# EAGLE design MultiboardV2 (EAGLE 9.2.2)
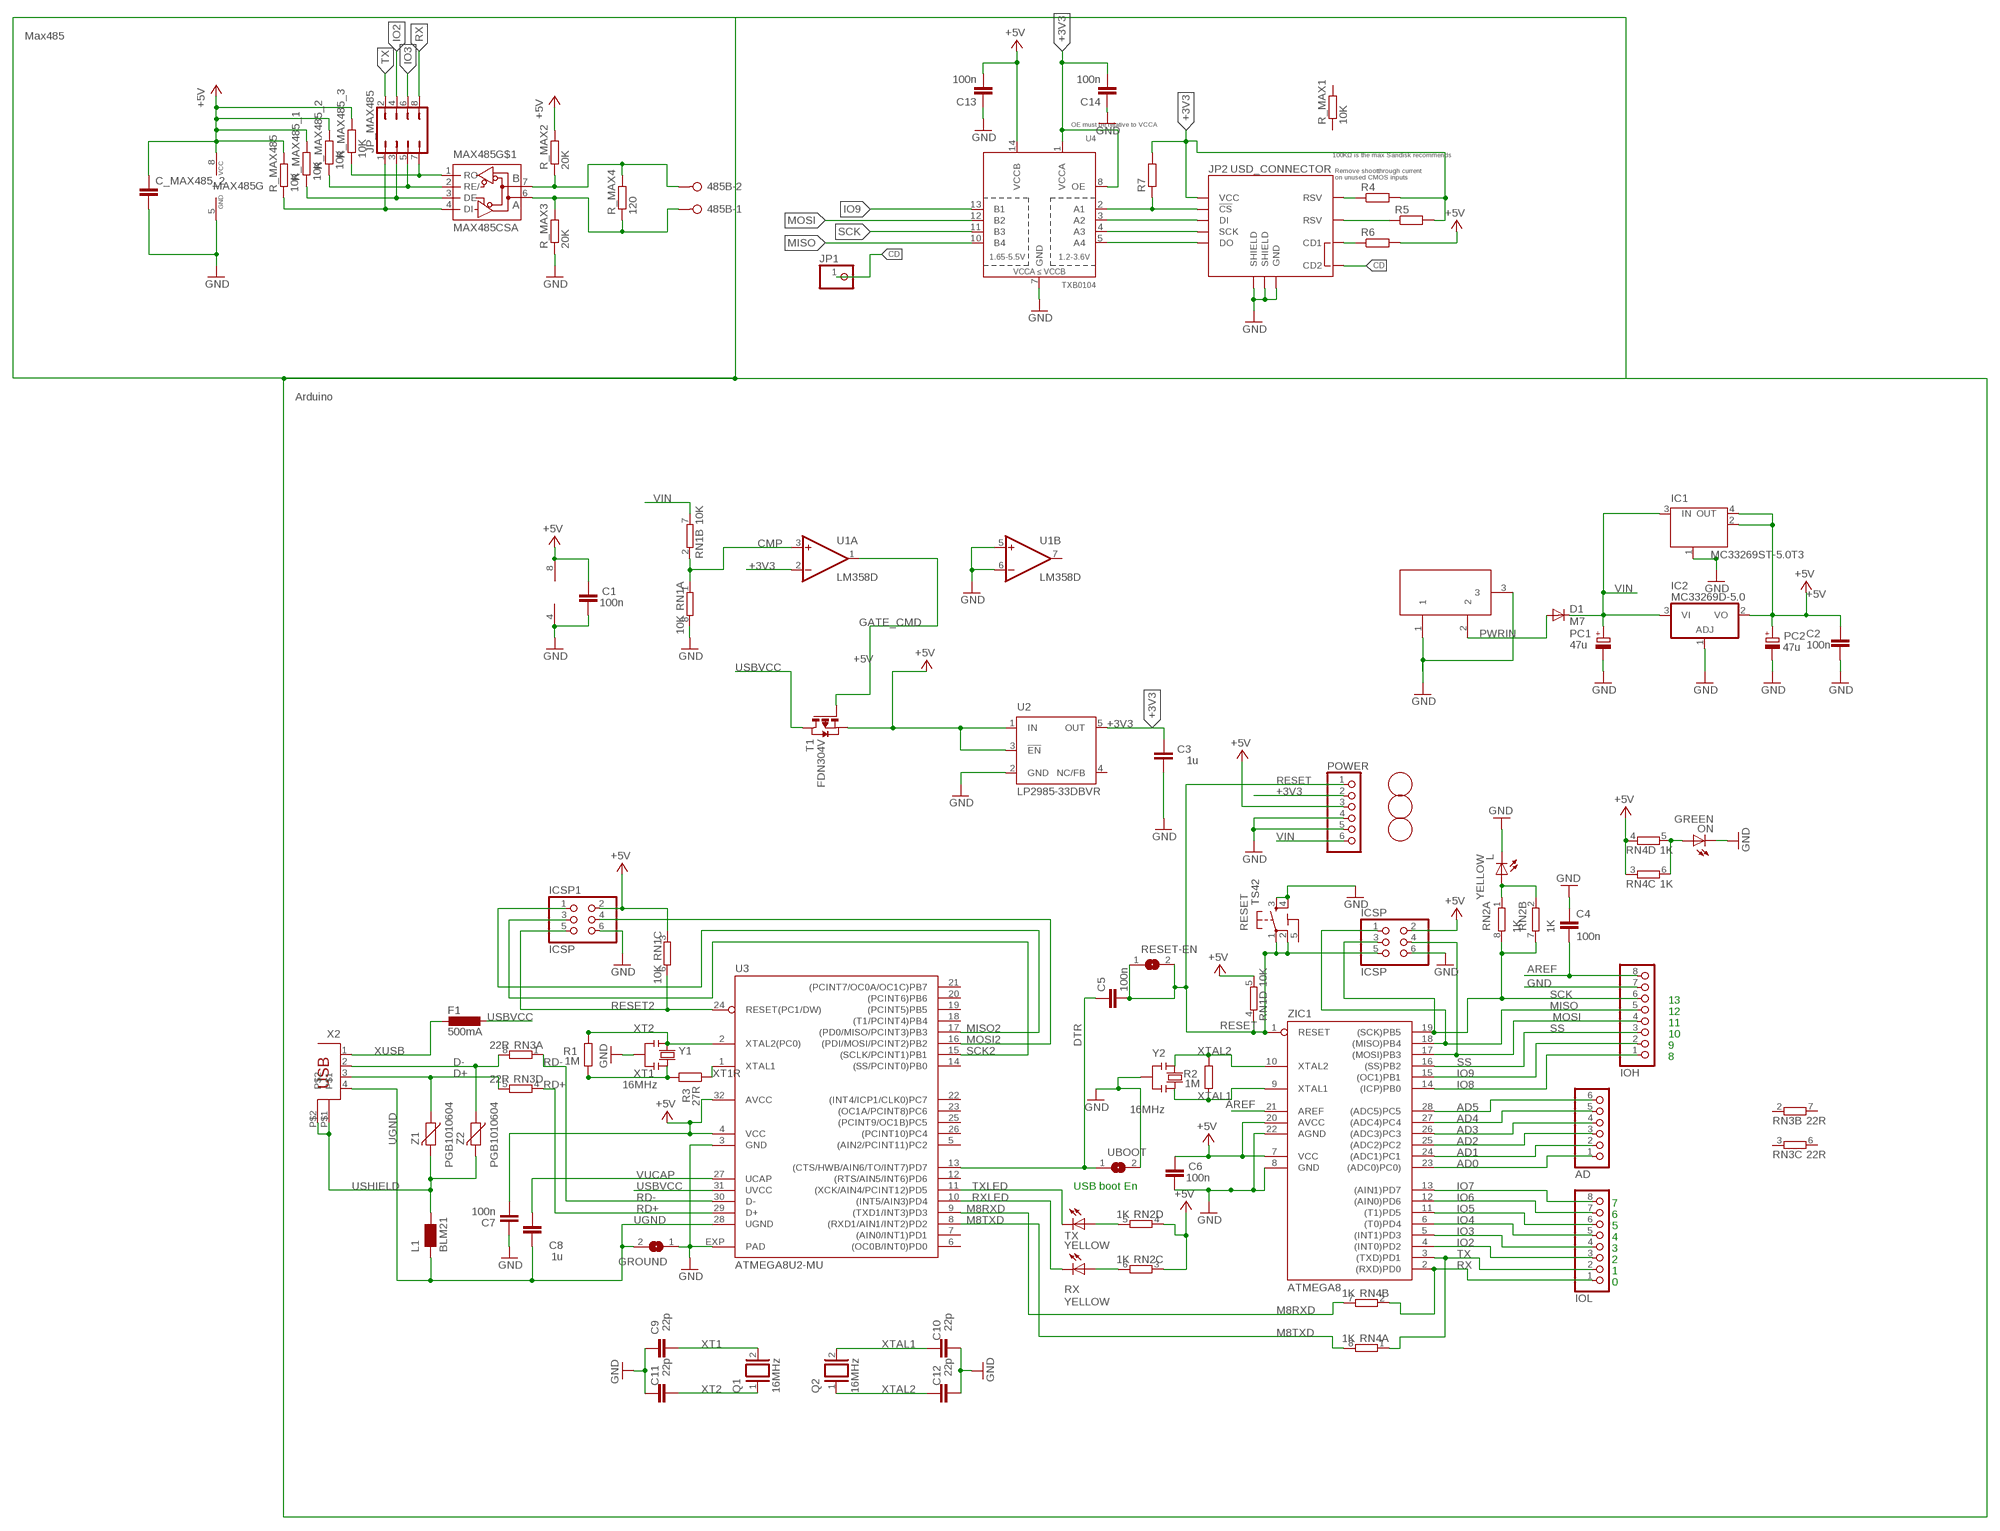
[diagram p0: schematic, sheet 1]

## Parts
485B  W237-02P  [W237-132]
AD  PINHD-1X6  [1X06]
C1  100n  C-EU0603-RND  [C0603-ROUND]
C2  100n  C-EU0603-RND  [C0603-ROUND]
C3  1u  C-EU0603-RND  [C0603-ROUND]
C4  100n  C-EU0603-RND  [C0603-ROUND]
C5  100n  C-EU0603-RND  [C0603-ROUND]
C6  100n  C-EU0603-RND  [C0603-ROUND]
C7  100n  C-EU0603-RND  [C0603-ROUND]
C8  1u  C-EU0603-RND  [C0603-ROUND]
C9  22p  C-EU0603-RND  [C0603-ROUND]
C10  22p  C-EU0603-RND  [C0603-ROUND]
C11  22p  C-EU0603-RND  [C0603-ROUND]
C12  22p  C-EU0603-RND  [C0603-ROUND]
C13  100n  C-EU0603-RND  [C0603-ROUND]
C14  100n  C-EU0603-RND  [C0603-ROUND]
C_MAX485_2  C-EUC0402  [C0402]
D1  M7  DIODE-SMB  [SMB]
F1  500mA  L-EUL1812  [L1812]
GROUND  SJ  [SJ]
IC1  MC33269ST-5.0T3  MC33269ST-3.3T3  [SOT223]
IC2  MC33269D-5.0  [DPACK]
ICSP  ICSP  PINHD-2X3  [2X03]
ICSP1  ICSP  PINHD-2X3  [2X03]
IOH  PINHD-1X8  [1X08]
IOL  PINHD-1X8  [1X08]
JP1  PINHD-1X1  [1X01]
JP2  USD_CONNECTOR  [MICRO-SD-SOCKET-PP]
JP_MAX485  JP4Q  [JP4Q]
L  YELLOW  LEDCHIP-LED0805  [CHIP-LED0805]
L1  BLM21  WE-CBF_0805  [0805]
MAX485  MAX485CSA  [SO08]
ON  GREEN  LEDCHIP-LED0805  [CHIP-LED0805]
PC1  47u  CPOL-EUD  [PANASONIC_D]
PC2  47u  CPOL-EUD  [PANASONIC_D]
POWER  PINHD-1X6  [1X06]
Q1  16MHz  XTAL/S  [QS]
Q2  16MHz  XTAL/S  [QS]
R1  1M  R-EU_R0603  [R0603-ROUND]
R2  1M  R-EU_R0603  [R0603-ROUND]
R3  27R  R-EU_R0603  [R0603-ROUND]
R4  100k  R-EU_R0402  [R0402]
R5  100k  R-EU_R0402  [R0402]
R6  100k  R-EU_R0402  [R0402]
R7  100k  R-EU_R0402  [R0402]
R_MAX1  10K  R-EU_R0402  [R0402]
R_MAX2  20K  R-EU_R0402  [R0402]
R_MAX3  20K  R-EU_R0402  [R0402]
R_MAX4  120  R-EU_R0402  [R0402]
R_MAX485  10K  R-EU_R0402  [R0402]
R_MAX485_1  10K  R-EU_R0402  [R0402]
R_MAX485_2  10K  R-EU_R0402  [R0402]
R_MAX485_3  10K  R-EU_R0402  [R0402]
RESET  TS42  [TS42]
RESET-EN  SJ  [SJ]
RN1  10K  4R-NCAY16  [CAY16]
RN2  1K  4R-NCAY16  [CAY16]
RN3  22R  4R-NCAY16  [CAY16]
RN4  1K  4R-NCAY16  [CAY16]
RX  YELLOW  LEDCHIP-LED0805  [CHIP-LED0805]
T1  FDN304V  PMOSSOT23  [SOT-23]
TX  YELLOW  LEDCHIP-LED0805  [CHIP-LED0805]
U1  LM358D  [SO08]
U2  LP2985-33DBVR  TPS77033  [SOT23-DBV]
U3  ATMEGA8U2-MU  [QFN32]
U4  TXB0104  TXB0104PWRSOIC14  [SO14]
U$3  FIDUCIALMOUNT  [FIDUCIA-MOUNT]
U$4  FIDUCIALMOUNT  [FIDUCIA-MOUNT]
U$6  FIDUCIALMOUNT  [FIDUCIA-MOUNT]
UBOOT  SJ  [SJ]
X1  DC21MMX  [DC-21MM]
X2  PN61729  [PN61729]
Y1  16MHz  RESONATORMU  [RESONATOR]
Y2  16MHz  RESONATORMU  [RESONATOR]
Z1  PGB1010604  VARISTORCN0603  [CT/CN0603]
Z2  PGB1010604  VARISTORCN0603  [CT/CN0603]
ZIC1  ATMEGA8  AT90S4433P  [DIL28-3]

## Nets
!CS_3V3: JP2.CS(!CS) R7.1 U4.2(A1)
+3V3: C3.2 C14.2 JP2.VCC POWER.2 R4.2 R5.2 R7.2 U1.2(A:-IN) U2.5(OUT) U4.1(VCCA) U4.8(OE)
+5V: C1.2 C2.2 C6.2 C7.1 C13.2 C_MAX485_2.1 IC1.2(OUT) IC1.4(OUT) IC2.2(VO) ICSP1.2 ICSP.2 MAX485.8(G:VCC) PC2.+ POWER.3 R6.2 R_MAX2.2 R_MAX485.2 R_MAX485_1.2 R_MAX485_2.2 R_MAX485_3.2 RN1.3 RN1.5 RN2.3 RN2.4 RN4.3 RN4.4 T1.2(S) U1.8(P:V+) U2.1(IN) U2.3(!EN) U3.4(VCC) U3.32(AVCC) U4.14(VCCB) ZIC1.7(VCC) ZIC1.20(AVCC)
AD0: AD.1 ZIC1.23((ADC0)PC0))
AD1: AD.2 ZIC1.24((ADC1)PC1)
AD2: AD.3 ZIC1.25((ADC2)PC2)
AD3: AD.4 ZIC1.26((ADC3)PC3)
AD4: AD.5 ZIC1.27((ADC4)PC4)
AD5: AD.6 ZIC1.28((ADC5)PC5)
AREF: C4.2 IOH.8 ZIC1.21(AREF)
CD: JP1.1 JP2.CD2
CDSDSD: JP2.CD1 R6.1
CMP: RN1.1 RN1.2 U1.3(A:+IN)
D+: RN3.5 X2.3 Z1.1
D-: RN3.8 X2.2 Z2.1
DI_3V3: JP2.DI U4.3(A2)
DO_3V3: JP2.DO U4.5(A4)
DTR: C5.1 U3.13((CTS/HWB/AIN6/TO/INT7)PD7) UBOOT.1
GATE_CMD: T1.3(G) U1.1(A:OUT)
GND: C1.1 C2.1 C3.1 C4.1 C6.1 C7.2 C9.2 C10.1 C11.2 C12.1 C13.1 C14.1 C_MAX485_2.2 GROUND.1 IC1.1(GND/ADJ) IC2.1(ADJ) ICSP1.6 ICSP.6 IOH.7 JP2.GND JP2.GND1(SHIELD) JP2.GND3(SHIELD) L.C MAX485.5(G:GND) ON.C PC1.- PC2.- POWER.4 POWER.5 R_MAX3.1 RESET.3 RESET.4 RN1.8 U1.4(P:V-) U1.5(B:+IN) U1.6(B:-IN) U2.2(GND) U3.3(GND) U3.EXP(PAD) U4.7(GND) UBOOT.2 X1.1 X1.3 Y1.2 Y2.2 ZIC1.8(GND) ZIC1.22(AGND)
IO2: IOL.3 JP_MAX485.4 ZIC1.4((INT0)PD2)
IO3: IOL.4 JP_MAX485.6 ZIC1.5((INT1)PD3)
IO4: IOL.5 ZIC1.6((T0)PD4)
IO5: IOL.6 ZIC1.11((T1)PD5)
IO6: IOL.7 ZIC1.12((AIN0)PD6)
IO7: IOL.8 ZIC1.13((AIN1)PD7)
IO8: IOH.1 ZIC1.14((ICP)PB0)
IO9: IOH.2 U4.13(B1) ZIC1.15((OC1)PB1)
M8RXD: RN4.7 U3.9((TXD1/INT3)PD3)
M8TXD: RN4.8 U3.8((RXD1/AIN1/INT2)PD2)
MISO: ICSP.1 IOH.5 U4.10(B4) ZIC1.18((MISO)PB4)
MISO2: ICSP1.1 U3.17((PD0/MISO/PCINT3)PB3)
MOSI: ICSP.4 IOH.4 U4.12(B2) ZIC1.17((MOSI)PB3)
MOSI2: ICSP1.4 U3.16((PDI/MOSI/PCINT2)PB2)
N$2: L.A RN2.1 RN2.2
N$3: ON.A RN4.5 RN4.6
N$4: JP_MAX485.7 MAX485.1(RO) R_MAX485_3.1
N$5: JP_MAX485.5 MAX485.2(RE/) R_MAX485_2.1
N$6: JP_MAX485.3 MAX485.3(DE) R_MAX485_1.1
N$7: JP_MAX485.1 MAX485.4(DI) R_MAX485.1
N$9: 485B.2 MAX485.7(B) R_MAX2.1 R_MAX4.2
N$10: 485B.1 MAX485.6(A) R_MAX3.2 R_MAX4.1
N$35: RN2.6 RX.A
N$36: RN2.5 TX.A
PWRIN: D1.A X1.2
RD+: RN3.4 U3.29(D+)
RD-: RN3.1 U3.30(D-)
RESET: C5.2 ICSP.5 POWER.1 RESET-EN.1 RESET-EN.2 RESET.1 RESET.2 RN1.4 ZIC1.1(RESET)
RESET2: ICSP1.5 RN1.6 U3.24(RESET(PC1/DW))
RSV@1: JP2.RSV1(RSV) R4.1
RSV@2: JP2.RSV2(RSV) R5.1
RX: IOL.1 JP_MAX485.8 RN4.2 ZIC1.2((RXD)PD0)
RXLED: RX.C U3.10((INT5/AIN3)PD4)
SCK: ICSP.3 IOH.6 RN2.7 RN2.8 U4.11(B3) ZIC1.19((SCK)PB5)
SCK2: ICSP1.3 U3.15((SCLK/PCINT1)PB1)
SCK_3V3: JP2.SCLK(SCK) U4.4(A3)
SS: IOH.3 ZIC1.16((SS)PB2)
TX: IOL.2 JP_MAX485.2 RN4.1 ZIC1.3((TXD)PD1)
TXLED: TX.C U3.11((XCK/AIN4/PCINT12)PD5)
UGND: C8.2 GROUND.2 L1.1 U3.28(UGND) X2.4
USBVCC: F1.1 T1.1(D) U3.31(UVCC)
USHIELD: L1.2 X2.P$1 X2.P$2 Z1.2 Z2.2
VIN: D1.C IC1.3(IN) IC2.3(VI) PC1.+ POWER.6 RN1.7
VUCAP: C8.1 U3.27(UCAP)
XT1: C9.1 Q1.2 R1.1 R3.2 Y1.3
XT1R: R3.1 U3.1(XTAL1)
XT2: C11.1 Q1.1 R1.2 U3.2(XTAL2(PC0)) Y1.1
XTAL1: C10.2 Q2.2 R2.1 Y2.3 ZIC1.9(XTAL1)
XTAL2: C12.2 Q2.1 R2.2 Y2.1 ZIC1.10(XTAL2)
XUSB: F1.2 X2.1
Unconnected: R_MAX1.1 R_MAX1.2 RN3.2 RN3.3 RN3.6 RN3.7 U1.7(B:OUT) U2.4(NC/FB) U3.5((AIN2/PCINT11)PC2) U3.6((OC0B/INT0)PD0) U3.7((AIN0/INT1)PD1) U3.12((RTS/AIN5/INT6)PD6) U3.14((SS/PCINT0)PB0) U3.18((T1/PCINT4)PB4) U3.19((PCINT5)PB5) U3.20((PCINT6)PB6) U3.21((PCINT7/OC0A/OC1C)PB7) U3.22((INT4/ICP1/CLK0)PC7) U3.23((OC1A/PCINT8)PC6) U3.25((PCINT9/OC1B)PC5) U3.26((PCINT10)PC4)

## Notes on the sheet
- Max485
- OE must be relative to VCCA
- 100KΩ is the max Sandisk recommends
- Remove shootthrough current
  on unused CMOS inputs
- Arduino
- 13
- 12
- 11
- 10
- 9
- 8
- USB boot En
- 7
- 6
- 5
- 4
- 3
- 2
- 1
- 0

## Power pins joined to a net without a drawn wire
5-GND: RESET.5(5-GND)

## Library data of the parts
485B = con-wago-508:W237-02P: WAGO SREW CLAMP; OC_FARNELL: unknown; OC_NEWARK: unknown
AD POWER = pinhead:PINHD-1X6: PIN HEADER
C1-C14 = SmartPrj:C-EU: CAPACITOR, European symbol
C_MAX485_2 = rcl:C-EU: CAPACITOR, European symbol; SPICEPREFIX: C
D1 = diode:DIODE-: DIODE
F1 = rcl:L-EU: INDUCTOR, European symbol
GROUND RESET-EN UBOOT = jumper:SJ: SMD solder JUMPER
IC1 = linear:MC33269ST*: Adjustable Output Low Dropout Voltage Regulator 800 mA Source: http://www.onsemi.com/pub/Collateral/MC33269-D.PDF
IC2 = linear:MC33269?*: Adjustable Output Low Dropout Voltage Regulator 800 mA Source: http://www.onsemi.com/pub/Collateral/MC33269-D.PDF
ICSP ICSP1 = pinhead:PINHD-2X3: PIN HEADER
IOH IOL = pinhead:PINHD-1X8: PIN HEADER
JP1 = pinhead:PINHD-1X1: PIN HEADER
JP2 = SparkFun-Connectors:USD_CONNECTOR: microSD Socket Push-push type µSD socket. Footprint production proven. Symbol has new and improved layout and naming accuracy. SparkFun Electronics SKU : PRT-00127. tDoc lines correctly indicate media card edge positions when inserting (unlocked, locked, depressed). NOTE: CD1 and CD2 are connected internally; PROD_ID: CONN-07820
JP_MAX485 = jumper:JP4Q: JUMPER
L ON RX TX = led:LED: LED OSRAM: - CHIPLED LG R971, LG N971, LY N971, LG Q971, LY Q971, LO R971, LY R971 LH N974, LH R974 LS Q976, LO Q976, LY Q976 LO Q996 - Hyper CHIPLED LW Q18S LB Q993, LB Q99A, LB R99A - SideLED LS A670, LO A670, LY A670, LG A670, LP A670 LB A673, LV A673, LT A673, LW A673 LH A674 LY A675 LS A676, LA A676, LO A676, LY A676, LW A676 LS A679, LY A679, LG A679 - Hyper Micro SIDELED® LS Y876, LA Y876, LO Y876, LY Y876 LT Y87S - SmartLED LW L88C, LW L88S LB L89C, LB L89S, LG L890 LS L89K, LO L89K, LY L89K LS L896, LA L896, LO L896, LY L896 - TOPLED LS T670, LO T670, LY T670, LG T670, LP T670 LSG T670, LSP T670, LSY T670, LOP T670, LYG T670 LG T671, LOG T671, LSG T671 LB T673, LV T673, LT T673, LW T673 LH T674 LS T676, LA T676, LO T676, LY T676, LB T676, LH T676, LSB T676, LW T676 LB T67C, LV T67C, LT T67C, LS T67K, LO T67K, LY T67K, LW E67C LS E67B, LA E67B, LO E67B, LY E67B, LB E67C, LV E67C, LT E67C LW T67C LS T679, LY T679, LG T679 LS T770, LO T770, LY T770, LG T770, LP T770 LB T773, LV T773, LT T773, LW T773 LH T774 LS E675, LA E675, LY E675, LS T675 LS T776, LA T776, LO T776, LY T776, LB T776 LHGB T686 LT T68C, LB T68C - Hyper Mini TOPLED® LB M676 - Mini TOPLED Santana® LG M470 LS M47K, LO M47K, LY M47K Source: http://www.osram.convergy.de LUXEON: - LUMILED® LXK2-PW12-R00, LXK2-PW12-S00, LXK2-PW14-U00, LXK2-PW14-V00 LXK2-PM12-R00, LXK2-PM12-S00, LXK2-PM14-U00 LXK2-PE12-Q00, LXK2-PE12-R00, LXK2-PE12-S00, LXK2-PE14-T00, LXK2-PE14-U00 LXK2-PB12-K00, LXK2-PB12-L00, LXK2-PB12-M00, LXK2-PB14-N00, LXK2-PB14-P00, LXK2-PB14-Q00 LXK2-PR12-L00, LXK2-PR12-M00, LXK2-PR14-Q00, LXK2-PR14-R00 LXK2-PD12-Q00, LXK2-PD12-R00, LXK2-PD12-S00 LXK2-PH12-R00, LXK2-PH12-S00 LXK2-PL12-P00, LXK2-PL12-Q00, LXK2-PL12-R00 Source: www.luxeon.com KINGBRIGHT: KA-3528ASYC Source: www.kingbright.com
L1 = wuerth-elektronik:WE-CBF: SMD EMI Suppression Ferrite Beads - excellent anti-EMI properties - low DCR - impedances till 3000 ohms - rated current up to 6 A
MAX485 = andereBauteile:MAX485: MAX485 RS485 Half Duplex Driver
PC1 PC2 = rcl:CPOL-EU: POLARIZED CAPACITOR, European symbol
Q1 Q2 = special:XTAL/S: CRYSTAL
R1-R3 = SmartPrj:R-EU_: RESISTOR, European symbol
R4-R7 R_MAX1-R_MAX4 R_MAX485 R_MAX485_1-R_MAX485_3 = rcl:R-EU_: RESISTOR, European symbol; SPICEPREFIX: R
RESET = st-mod v1.4:TS42: TS42 Dongnan Electronics Tact switch VDC 12V - 50mA
RN1-RN4 = resistor-dil:4R-N: Array Chip Resistor Source: RS Component / Phycomp
T1 = zetex:PMOSSOT23: MOS FET
U1 = linear:LM358: OP AMP also LM158; LM258; LM2904 Source: http://cache.national.com/ds/LM/LM158.pdf
U2 = texas:TPS770*: ULTRALOW-POWER 50-mA LOW-DROPOUT LINEAR REGULATORS 50-mA Low-Dropout Regulator Source: http://focus.ti.com/lit/ds/symlink/tps77001.pdf
U3 = atmel:ATMEGA8U2-MU
U4 = SparkFun-DigitalIC:TXB0104PWR: 4-Bit Bi-Directional Level Shifter 1.2V-3.6V (VCCA) to 1.65V-5.5V (VCCB) bi-directional level shifter with auto direction sensing. Max data rate - VCCA 1.8V: 20Mbps (50ns), VCCA 3.3V: 100Mbps (10ns) Digikey: 296-21929-1-ND (TSSOP) IC-11329; PROD_ID: IC-11329
U$3 U$4 U$6 = SmartPrj:FIDUCIALMOUNT
X1 = powersupply:DC21MM
X2 = SmartPrj:PN61729: BERG USB connector
Y1 Y2 = SmartPrj:RESONATOR
Z1 Z2 = varistor:VARISTOR: VARISTOR
ZIC1 = atmel:AT90S4433: MICROCONTROLLER 4 Kbytes FLASH 128 bytes SRAM 256 bytes EEPROM UART 6-channel 10 bit ADC

## Board
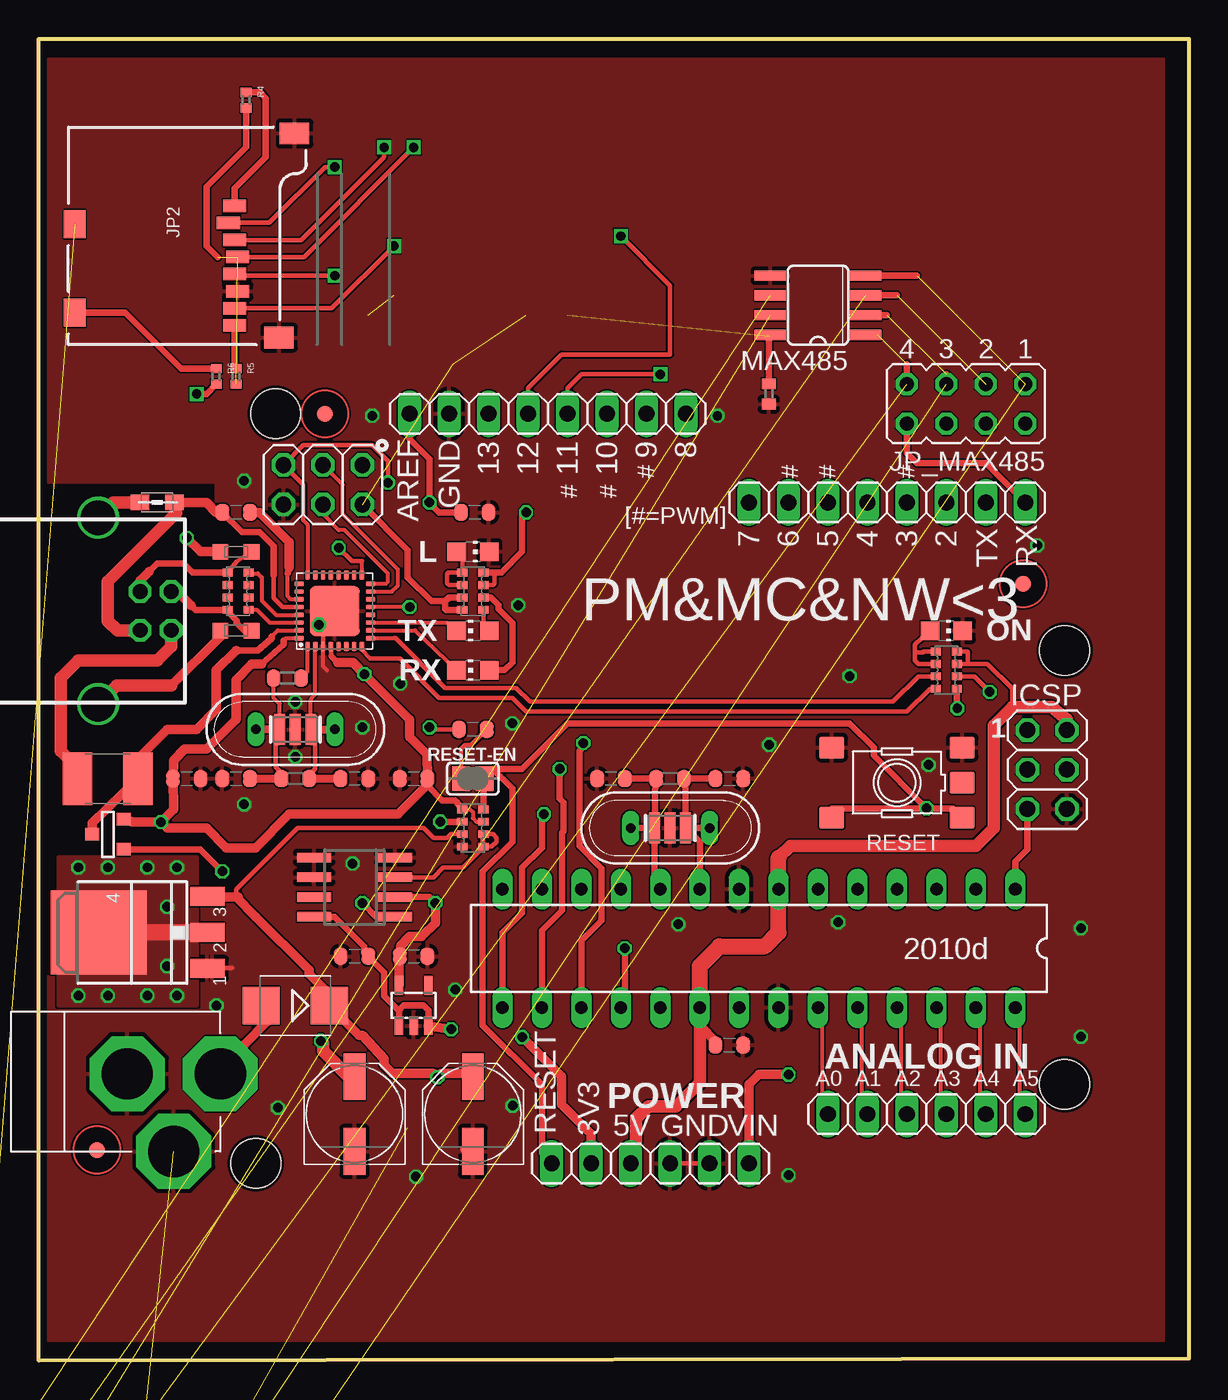
[diagram p1: board, top side]
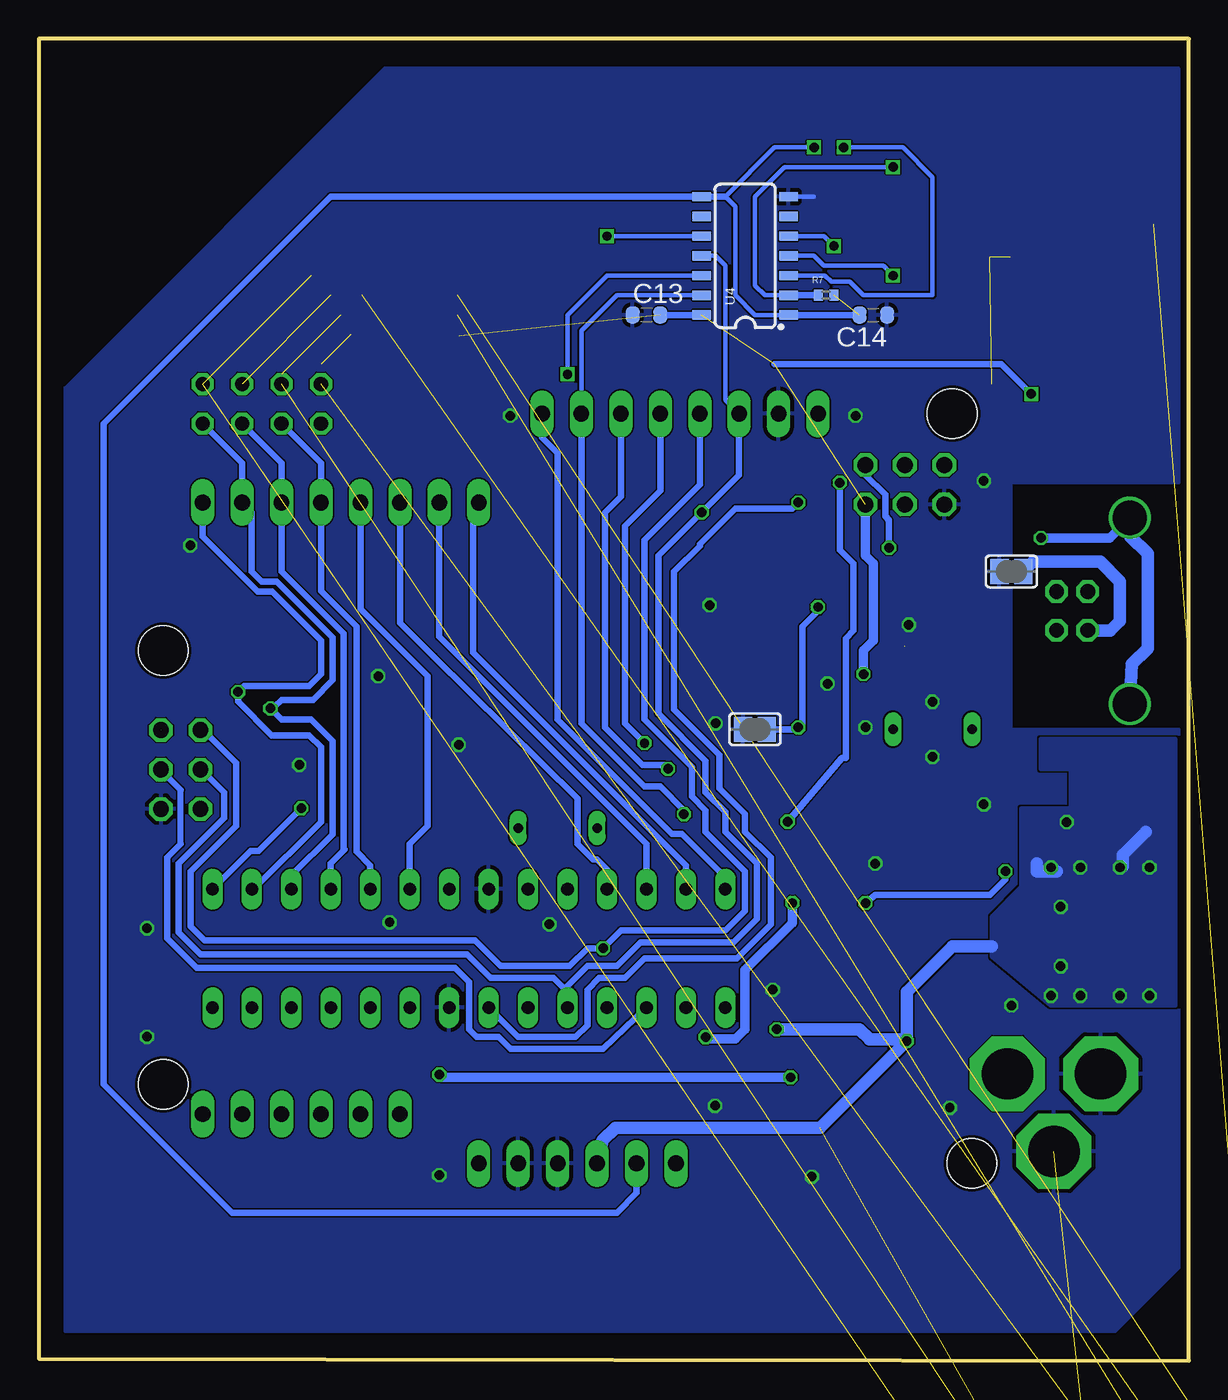
[diagram p2: board, bottom side, seen from below]

Size 74.04 x 85.09 mm. Coordinates in mm from the lower left corner, seen from the top.
Outline: 0,85.09 74.04,85.09 74.04,0.13 0,0 0,85.09
Copper layers (1*16): Top 0.035mm / dielectric 1.5mm / Bottom 0.035mm
Design rules "Aisler": minimum track width 0.1mm, minimum drill 0.2mm, track to track 0.1mm, track to pad 0.1mm, pad to pad 0.1mm, via to via 0.1mm, smd to smd 0.1mm, copper to edge 0.2mm, drill to drill 0.21mm, minimum pad ring 0.25mm, minimum via ring 0.15mm, stop-mask expansion 0mil, vias tented up to drill 0mil, thermal gap 10mil
Holes 3.2 mm at 66.04,45.72 66.04,17.78 15.24,60.96 13.97,12.7
vRestrict: area 0.6,32 to 2,40.3; area 5.7,32.8 to 7.4,40.3; area 47.9,20.4 to 48.5,21; area 50.4,20.3 to 50.9,21.2; area 11.3,39 to 12.7,41.3; area 0.3,22.6 to 9.4,34.7

### Footprints (pad centres in the part's own frame; a part is rotated, then mirrored left to right if it is on the bottom)
W237-132 = drill 1.194 long: 1 -2.54,-0.635; 2 2.54,-0.635
1X06 = drill 1.016 long: 1 -6.35,0; 2 -3.81,0; 3 -1.27,0; 4 1.27,0; 5 3.81,0; 6 6.35,0
C0603-ROUND = smd 0.898 x 1.1: 1 -0.889,0; 2 0.889,0
C0402 = smd 0.7 x 0.9: 1 -0.65,0; 2 0.65,0
SMB = smd 2.4 x 2.4: A 2.2,0; C -2.2,0
L1812 = smd 1.9 x 3.4: 1 -1.95,0; 2 1.95,0
SJ = smd 1.168 x 1.6: 1 -0.762,0; 2 0.762,0
SOT223 = smd 1.219 x 2.235: 1 -2.311,-3.099; 2 0,-3.099; 3 2.311,-3.099 | smd 3.6 x 2.2: 4 0,3.099
DPACK = smd 1 x 1.6: 1 -2.28,-4.8; 3 2.28,-4.8 | smd 5.4 x 6.2: 2 0,2.5
2X03 = drill 1.016 octagon: 1 -2.54,-1.27; 2 -2.54,1.27; 3 0,-1.27; 4 0,1.27; 5 2.54,-1.27; 6 2.54,1.27
1X08 = drill 1.016 long: 1 -8.89,0; 2 -6.35,0; 3 -3.81,0; 4 -1.27,0; 5 1.27,0; 6 3.81,0; 7 6.35,0; 8 8.89,0
1X01 = drill 1.016 octagon: 1 0,0
MICRO-SD-SOCKET-PP = smd 1.8 x 1.4: CD1 -2.05,0.4; CD2 -7.75,0.4 | smd 0.8 x 1.5: CS -7.84,10.3; DI -6.74,10.7; DO -2.34,10.7; GND -3.44,10.9; RSV1 -8.94,10.7; RSV2 -1.24,10.7; SCLK -4.54,10.7; VCC -5.64,10.9 | smd 1.4 x 1.9: GND1 -13.6,14.55; GND3 -0.45,13.55
JP4Q = drill 0.914 octagon: 1 -3.81,-1.27; 2 -3.81,1.27; 3 -1.27,-1.27; 4 -1.27,1.27; 5 1.27,-1.27; 6 1.27,1.27; 7 3.81,-1.27; 8 3.81,1.27
CHIP-LED0805 = smd 1.2 x 1.2: A 0,-1.05; C 0,1.05
0805 = smd 1.2 x 1: 1 -1.1,0; 2 1.1,0
SO08 = smd 0.66 x 2.032: 1 -1.905,-3.073; 2 -0.635,-3.073; 3 0.635,-3.073; 4 1.905,-3.073; 5 1.905,3.073; 6 0.635,3.073; 7 -0.635,3.073; 8 -1.905,3.073
PANASONIC_D = smd 3 x 1.4: + 2.4,0; - -2.4,0
QS = drill 0.61 long: 1 -2.54,0; 2 2.54,0
R0603-ROUND = smd 0.898 x 1.1: 1 -0.889,0; 2 0.889,0
R0402 = smd 0.6 x 0.7: 1 -0.5,0; 2 0.5,0
TS42 = smd 1.6 x 1.4: 1 -4.2,2.25; 2 4.2,2.25; 3 -4.2,-2.25; 4 4.2,-2.25; 5 -4.2,0
CAY16 = smd 0.5 x 0.65: 1 -1.2,-0.675; 2 -0.4,-0.675; 3 0.4,-0.675; 4 1.2,-0.675; 5 1.2,0.675; 6 0.4,0.675; 7 -0.4,0.675; 8 -1.2,0.675
SOT-23 = smd 0.787 x 0.889: 1 0.025,-1.016; 2 -0.94,1.016; 3 0.991,1.016
SO08' = smd 0.6 x 2.2: 1 -1.905,-2.6; 2 -0.635,-2.6; 3 0.635,-2.6; 4 1.905,-2.6; 5 1.905,2.6; 6 0.635,2.6; 7 -0.635,2.6; 8 -1.905,2.6
SOT23-DBV = smd 0.55 x 1.2: 1 -0.95,-1.3; 2 0,-1.3; 3 0.95,-1.3; 4 0.95,1.3; 5 -0.95,1.3
QFN32 = smd 0.6 x 0.3: 1 -2.3,1.75; 2 -2.3,1.25; 3 -2.3,0.75; 4 -2.3,0.25; 5 -2.3,-0.25; 6 -2.3,-0.75; 7 -2.3,-1.25; 8 -2.3,-1.75; 17 2.3,-1.75; 18 2.3,-1.25; 19 2.3,-0.75; 20 2.3,-0.25; 21 2.3,0.25; 22 2.3,0.75; 23 2.3,1.25; 24 2.3,1.75 | smd 0.3 x 0.6: 9 -1.75,-2.3; 10 -1.25,-2.3; 11 -0.75,-2.3; 12 -0.25,-2.3; 13 0.25,-2.3; 14 0.75,-2.3; 15 1.25,-2.3; 16 1.75,-2.3; 25 1.75,2.3; 26 1.25,2.3; 27 0.75,2.3; 28 0.25,2.3; 29 -0.25,2.3; 30 -0.75,2.3; 31 -1.25,2.3; 32 -1.75,2.3 | smd 3.2 x 3.2: EXP 0,0
SO14 = smd 0.6 x 1.2: 1 -3.81,-2.8; 2 -2.54,-2.8; 3 -1.27,-2.8; 4 0,-2.8; 5 1.27,-2.8; 6 2.54,-2.8; 7 3.81,-2.8; 8 3.81,2.8; 9 2.54,2.8; 10 1.27,2.8; 11 0,2.8; 12 -1.27,2.8; 13 -2.54,2.8; 14 -3.81,2.8
FIDUCIA-MOUNT = smd 1.016 x 1.016: P$1 0,0
DC-21MM = drill 3.302 pad 4.826 octagon: 1 -5.08,-3.353; 2 -0.076,-6.35; 3 -0.076,-0.356
PN61729 = drill 0.95 octagon: 1 1.25,4.71; 2 -1.25,4.71; 3 -1.25,2.71; 4 1.25,2.71 | drill 2.2: P$1 -6,0; P$2 6,0
RESONATOR = smd 0.7 x 2: 1 -1,0; 2 0,0; 3 1,0
CT/CN0603 = smd 1 x 1: 1 -1,0; 2 1,0
DIL28-3 = drill 0.813 long: 1 -16.51,-3.81; 2 -13.97,-3.81; 3 -11.43,-3.81; 4 -8.89,-3.81; 5 -6.35,-3.81; 6 -3.81,-3.81; 7 -1.27,-3.81; 8 1.27,-3.81; 9 3.81,-3.81; 10 6.35,-3.81; 11 8.89,-3.81; 12 11.43,-3.81; 13 13.97,-3.81; 14 16.51,-3.81; 15 16.51,3.81; 16 13.97,3.81; 17 11.43,3.81; 18 8.89,3.81; 19 6.35,3.81; 20 3.81,3.81; 21 1.27,3.81; 22 -1.27,3.81; 23 -3.81,3.81; 24 -6.35,3.81; 25 -8.89,3.81; 26 -11.43,3.81; 27 -13.97,3.81; 28 -16.51,3.81

### Placement (x,y rotation side)
485B  -8.26,-18.41 0 top  (outside the outline)
AD  57.15,15.88 0 top
C1  20.32,26.04 0 top
C2  9.53,37.47 180 top
C3  24.13,26.04 180 top
C4  28.07,54.61 180 top
C5  27.94,40.64 0 top
C6  44.45,20.32 180 top
C7  24.13,37.47 180 top
C8  12.7,54.61 180 top
C9  12.7,37.47 180 top
C10  44.45,37.47 180 top
C11  20.32,37.47 0 top
C12  36.83,37.47 0 top
C13  34.92,67.31 0 bottom
C14  20.32,67.31 180 bottom
C_MAX485_2  46.99,62.23 270 top
D1  16.51,22.86 180 top
F1  4.45,37.47 180 top
GROUND  11.43,50.8 0 bottom
IC1  7.75,27.56 90 top
IC2  6.35,27.56 90 top
ICSP  64.91,38.05 270 top
ICSP1  18.29,56.39 180 top
IOH  32.77,60.96 180 top
IOL  54.61,55.25 180 top
JP1  -11.43,-97.79 0 top  (outside the outline)
JP2  1.91,65.41 270 top
JP_MAX485  59.69,61.59 180 top
L  27.94,52.07 270 top
L1  7.62,55.25 180 top
MAX485  50.16,67.94 90 top
ON  58.42,46.99 270 top
PC1  27.94,15.88 90 top
PC2  20.32,15.88 90 top
POWER  39.37,12.7 0 top
Q1  16.51,40.64 180 top
Q2  40.64,34.29 0 top
R1  16.51,37.47 0 top
R2  40.64,37.47 180 top
R3  16,43.94 180 top
R4  13.34,81.14 270 top
R5  12.7,63.36 270 top
R6  11.43,63.36 270 top
R7  23.36,68.58 0 bottom
R_MAX1  -12.7,-101.6 0 top  (outside the outline)
R_MAX2  -4.45,-36.19 0 top  (outside the outline)
R_MAX3  3.81,-36.19 0 top  (outside the outline)
R_MAX4  -12.7,-41.28 0 top  (outside the outline)
R_MAX485  0,-31.11 0 top  (outside the outline)
R_MAX485_1  -12.7,-26.04 0 top  (outside the outline)
R_MAX485_2  0,-26.04 0 top  (outside the outline)
R_MAX485_3  -12.7,-31.11 0 top  (outside the outline)
RESET  55.24,37.21 180 top
RESET-EN  27.94,37.47 0 top
RN1  27.94,34.29 90 top
RN2  27.94,49.53 270 top
RN3  12.83,49.53 90 top
RN4  58.42,44.45 90 top
RX  27.94,44.45 90 top
T1  4.45,33.91 270 top
TX  27.94,46.99 90 top
U1  LM358D  [SO08']  20.32,30.48 90 top
U2  24.13,22.86 0 top
U3  19.05,48.26 90 top
U4  28.57,71.12 90 bottom
U$3  18.41,60.96 0 top
U$4  63.37,50.02 0 top
U$6  3.73,13.57 0 top
UBOOT  27.94,40.64 180 bottom
X1  5.33,18.54 90 top
X2  3.81,48.26 270 top
Y1  16.51,40.64 180 top
Y2  40.64,34.29 0 top
Z1  12.7,52.07 180 top
Z2  12.7,46.99 180 top
ZIC1  46.35,26.54 180 top

### Tracks (layer width: path | path; a pad name or v marks a point on that pad's centre or on a via)
!CS_3V3  (via drill 0.6 pad 0.6)
  Top 0.305: v19.05,76.83 18.41,76.83 14.82,73.25 JP2.CS
  Bottom 0.305: U4.2 26.04,68.58 27.3,68.58 27.94,69.22 27.94,74.93 26.04,76.83 v19.05,76.83
  Bottom 0.406: R7.1 26.04,68.58
+3V3  (via drill 0.6 pad 0.6, 0.61)  (3 unrouted)
  Top 0.305: v24.13,78.1 17.07,71.05 JP2.VCC
  Top 0.406: U1.2 25.15,29.84 v25.53,29.46 | R4.2 13.34,78.1 10.79,75.56 10.79,71.75 11.51,71.05
  Top 0.61: POWER.2 35.56,14.61 33.66,16.51 33.66,18.29 v31.11,20.83 31.62,20.32 | U2.5 23.18,25.94 C3.2 23.28,26.71 23.88,27.3 24.64,27.3 25.53,28.19 v25.53,29.46
  Bottom 0.305: v24.13,78.1 26.67,78.1 29.84,74.93 29.21,74.3 29.21,68.58 27.94,67.31 U4.1
  Bottom 0.406: POWER.2 35.56,10.79 36.83,9.53 61.59,9.53 69.85,17.78 69.85,60.33 55.24,74.93 U4.8 29.84,74.93 | U4.1 C14.2
  Bottom 0.61: v31.11,20.83 30.99,20.7 29.21,20.7 28.57,21.34 28.57,25.15 25.53,28.19 v25.53,29.46
+5V  (via drill 0.6 pad 0.6, 0.61)  (9 unrouted)
  Top 0.254: U3.32 15.9,46.51 15.75,46.36 | RN1.3 28.18,34.69 27.94,34.92 27.94,35.31 27.76,35.49 RN1.5
  Top 0.305: 18.8,45.36 U3.4 | 59.82,44.85 61.07,44.85 62.66,43.26 62.66,42.09 | 59.82,44.85 RN4.3 | RN4.4 59.76,45.65 59.82,45.59 59.82,44.85
  Top 0.356: 19.23,44.93 18.8,45.36
  Top 0.406: RN2.3 26.4,49.13 26.16,48.89 | RN2.4 26.22,48.33 26.16,48.39 26.16,48.89 | 26.16,48.89 25.27,48.89 23.75,50.42 23.75,52.2 ICSP1.2 | 15.75,46.36 15.75,46.1 14.35,44.83 | 42.55,20.32 42.35,20.51 | 23.18,22.55 U2.1 | 23.18,22.55 23.5,22.86 24.77,22.86 25.08,22.55 U2.3 | U1.8 19.05,28.57 20.95,26.67 20.95,26.25 C1.2 22.23,24.98 22.23,23.5 23.18,22.55 | RN1.5 26.87,36 26.8,36.07 25.96,36.07 24.98,37.05 | C_MAX485_2.1 46.99,65.94 MAX485.8 | R6.2 10.79,62.23 v10.16,62.23
  Top 0.508: 11.02,27.58 IC1.2
  Top 0.61: U2.3 25.05,21.56 v26.54,21.34 | C6.2 43.6,20.54 42.55,21.59 | T1.2 6.02,34.67 v7.87,34.67 | v7.87,34.67 8.68,35.47 C2.2 8.68,38.65 9.4,39.37 10.79,39.37 12.7,41.27 12.7,43.81 13.72,44.83 14.35,44.83 | v7.87,34.67 8.26,34.29 10.79,34.29 12.06,33.02 13.97,33.02 16.13,35.18 23.11,35.18 24.98,37.05 C7.1 24.98,39.03 23.88,40.13 23.88,41.27 v20.95,44.2 20.22,44.93 19.23,44.93
  Top 0.813: POWER.3 38.46,14.17 38.46,15.6 39.24,16.38 41.02,16.38 42.55,17.91 42.55,20.32 42.55,21.59 ZIC1.20 | 47.62,32.39 48.39,33.15 60.33,33.15 61.47,34.29 61.47,40.89 62.66,42.09 65.23,42.09 66.17,41.27 66.17,40.6 | PC2.+ 19.95,18.27 18.29,19.94 18.29,20.45 v18.16,20.57
  Top 1.016: IC1.4 5.84,27.56 5.87,27.58 11.02,27.58 | 47.62,32.39 ZIC1.7 47.62,27.56 46.74,26.67 43.81,26.67 42.55,25.4 ZIC1.20
  Bottom 0.406: U4.14 C13.2 | v10.16,62.23 12.06,64.14 26.67,64.14
  Bottom 0.61: 20.56,20.69 20.57,20.7 | v4.45,31.75 4.27,31.83 | v20.95,44.2 20.95,45.72 20.32,46.36 20.32,51.31 20.83,51.82 ICSP1.2
  Bottom 0.813: POWER.3 37.74,14.17 36.93,14.99 23.75,14.99 v18.16,20.57 | v8.89,31.75 8.51,31.5 9.78,31.5 9.78,32 | 4.27,31.83 4.27,32.56 2.79,34.04 | 12.7,26.67 15.24,26.67 18.16,23.75 v18.16,20.57 | 20.57,20.7 21.21,21.34 v26.54,21.34 | 20.56,20.69 18.27,20.69 v18.16,20.57
  other vias: 2.54,31.75 6.99,31.75 2.54,23.5 4.45,23.5 6.99,23.5 8.89,23.5 8.26,25.4 8.26,29.21
  pour Top (no thermals): 1.91,31.75 2.54,32.39 8.26,32.39 10.16,30.48 10.16,24.77 8.26,22.86 2.54,22.86 1.91,23.5
  pour Bottom (no thermals): 0.89,40 9.53,40 9.53,38.1 7.62,38.1 7.62,35.56 10.79,35.56 10.79,30.48 12.7,28.57 12.7,26.04 8.89,22.86 0.89,22.86
  pour Top (no thermals): 1.91,31.75 2.54,32.39 8.26,32.39 10.16,30.48 10.16,24.77 8.26,22.86 2.54,22.86 1.91,23.5
  pour Top (no thermals): 1.27,22.86 1.27,32.39 10.16,32.39 10.16,22.86
AD0
  Top 0.254: ZIC1.23 50.44,22.33 50.44,16.33 AD.1
AD1
  Top 0.254: ZIC1.24 52.98,22.33 52.98,16.33 AD.2
AD2
  Top 0.254: ZIC1.25 55.52,22.33 55.52,16.33 AD.3
AD3
  Top 0.254: ZIC1.26 58.06,22.33 58.06,16.33 AD.4
AD4
  Top 0.254: ZIC1.27 60.6,22.33 60.6,16.33 AD.5
AD5
  Top 0.254: ZIC1.28 63.14,22.33 63.14,16.33 AD.6
AREF  (via drill 0.61)
  Top 0.406: IOH.8 23.88,59.31 25.15,58.04 v25.15,55.25 25.78,54.61 C4.2
  Bottom 0.406: ZIC1.21 43.18,20.83 39.5,20.83 38.73,21.59 38.73,23.88 37.97,24.64 36.32,24.64 35.05,25.91 29.08,25.91 26.92,28.07 26.92,32.39 28.57,34.04 28.57,35.18 30.23,36.83 30.23,38.99 33.15,41.91 33.15,50.8 31.5,52.45 31.5,52.58 29.21,54.86 25.53,54.86 v25.15,55.25
CD  (1 unrouted)
CDSDSD
  Top 0.406: JP2.CD1 5.57,67.45 9.16,63.86 R6.1
CMP
  Top 0.305: U1.3 25.4,31.11 26.04,31.75 27.3,31.75 28.57,33.02 28.57,33.69 RN1.1 29.15,33.09 29.46,33.4 29.46,33.66 29.23,33.89 RN1.2
D+
  Top 0.305: Z1.1 12.73,51.44 RN3.5
  Top 0.406: 7.11,50.8 7.62,51.31 9.31,51.31 9.89,50.73 RN3.5
  Top 0.61: X2.3 6.52,50.21 7.11,50.8
D-
  Top 0.406: Z2.1 13.21,46.99 12.75,47.5 12.75,47.66 12.19,48.18 12.1,48.26 RN3.8 10.09,48.33 9.82,48.6
  Top 0.61: X2.2 8.91,49.51 9.82,48.6
DI_3V3  (via drill 0.6 pad 0.6)
  Top 0.305: JP2.DI 16.9,72.14 22.23,77.47 v22.23,78.1
  Bottom 0.305: v22.23,78.1 18.41,78.1 16.51,76.2 16.51,68.58 20.95,68.58 21.82,69.44 23.03,69.44 23.43,69.85 U4.3
DO_3V3  (via drill 0.6 pad 0.6)
  Top 0.305: v22.86,71.75 18.85,67.75 JP2.DO
  Bottom 0.305: U4.5 23.5,72.39 v22.86,71.75
DTR  (via drill 0.61)
  Top 0.254: U3.13 23.75,48.51 v23.88,48.51
  Top 0.305: C5.1 25.27,40.64 v25.15,40.77
  Bottom 0.406: v23.88,48.51 23.88,48.26 24.89,47.24 24.89,41.02 v25.15,40.77 25.27,40.64 UBOOT.1
GATE_CMD  (via drill 0.61)
  Top 0.406: U1.1 21.72,28.57 v20.83,29.46 | v11.81,31.5 10.39,32.92 T1.3
  Bottom 0.406: v11.81,31.5 11.81,30.99 12.83,29.97 20.19,29.97 v20.83,29.46
GND  (via drill 0.61)  (2 unrouted)
  Top 0.203: U3.EXP 18.92,48.26 v18.03,47.37
  Top 0.254: 18.55,44.44 18.3,44.69 U3.3
  Top 0.305: POWER.4 POWER.5 | IC2.1 12.45,25.3 IC1.1 | 19.86,13.46 PC2.- | 18.31,45.97 18.31,46.86
  Top 0.406: 27.3,13.59 PC1.-
  Bottom 0.305: GROUND.1 10.79,50.8 | U4.7 24.13,74.93
  other vias: 30.51,16.41 26.8,23.88 20.83,40.77 15.39,16.28 23.27,43.59 52.2,44.07 30.86,48.64 11.43,22.86 41.17,28.09 51.46,28.22 30.48,41.02 43.69,60.83 48.26,11.94 16.51,38.86 57.28,38.35 24.28,11.84 67.08,20.85 64.29,52.48 13.21,35.81 67.08,27.84 20.19,32 13.21,56.64 21.46,60.83 47.02,39.65 16.51,42.42
  pour Bottom (rank 2): 0.64,83.19 51.82,83.19 72.39,62.61 72.39,1.9 4.7,1.9 0.64,5.97 0.64,40.64 11.43,40.64 11.43,56.52 0.64,56.52
  pour Top (rank 2): 0.64,83.82 72.39,83.82 72.39,1.27 0.64,1.27 0.64,40.64 11.43,40.64 11.43,56.52 0.64,56.52
IO2
  Bottom 0.406: ZIC1.4 55.24,32 54.42,32.83 | 54.42,32.83 54.36,32.89 | IOL.3 58.42,54.86 | 54.42,32.83 54.42,46.8 58.42,50.8 IOL.3 | IOL.3 58.42,57.78 JP_MAX485.4
IO3
  Bottom 0.406: ZIC1.5 52.7,31.88 53.59,32.77 53.59,47.24 55.88,49.53 IOL.4 55.88,57.78 JP_MAX485.6
IO4
  Bottom 0.406: 53.53,55.06 IOL.5 53.34,48.39 49.02,44.07 49.02,34.42 50.16,33.27 ZIC1.6
IO5
  Bottom 0.406: ZIC1.11 37.47,31.62 38.1,32.26 38.35,32.26 39.37,33.27 39.37,36.2 48.64,45.34 50.8,47.5 IOL.6
IO6
  Bottom 0.406: ZIC1.12 34.92,33.27 48.26,46.61 IOL.7
IO7
  Bottom 0.406: ZIC1.13 32.38,31.88 46.1,45.59 46.1,54.86 IOL.8
IO8
  Bottom 0.406: ZIC1.14 29.84,31.11 32.64,33.91 33.27,33.91 40.64,41.27 40.64,58.42 41.66,59.44 IOH.1
IO9  (via drill 0.61)
  Top 0.406: ZIC1.15 29.84,27.56 31.11,28.83 31.11,31.75 32.38,33.02 32.38,35.05 v32.51,35.18
  Bottom 0.305: IOH.2 39.12,66.29 36.83,68.58 U4.13
  Bottom 0.406: v32.51,35.18 32.51,35.43 34.04,36.96 35.05,36.96 39.12,41.02 IOH.2
M8RXD
  Top 0.254: U3.9 22.86,46.51
  Top 0.305: RN4.7 56.62,44.05 54.99,42.42 31.62,42.42 30.73,43.31 26.16,43.31 22.96,46.51 22.86,46.51
M8TXD
  Top 0.254: U3.8 20.8,45.75 21.34,45.21
  Top 0.305: RN4.8 57.35,43.25 55.88,41.78 31.37,41.78 30.48,42.67 25.78,42.67 23.24,45.21 21.34,45.21
MISO  (via drill 0.6 pad 0.6, 0.61)
  Top 0.305: IOH.5 31.5,62.61 33.66,64.77 40.64,64.77 40.64,69.22 v37.47,72.39
  Top 0.406: v37.72,26.54 37.72,22.99 ZIC1.18
  Bottom 0.305: v37.47,72.39 U4.10
  Bottom 0.406: IOH.5 31.5,56.39 35.05,52.83 35.05,41.27 32,38.23 32,36.32 31.11,35.43 31.11,34.04 28.57,31.5 28.57,28.96 29.84,27.69 36.58,27.69 v37.72,26.54 | ICSP.1 63.45,40.59 61.34,38.48 61.34,34.42 64.26,31.5 64.26,27.94 63.37,27.05 45.97,27.05 44.32,25.4 39.88,25.4 38.73,26.54 v37.72,26.54 | v37.72,26.54 37.85,26.29 37.85,26.42
MISO2  (via drill 0.61)
  Top 0.254: U3.17 20.8,51.46
  Top 0.305: 20.8,51.46 20.16,51.46 v19.3,52.32
  Bottom 0.406: v19.3,52.32 19.3,54.1 19.56,54.36 19.56,55.75 20.83,57.02 ICSP1.1
MOSI  (via drill 0.6 pad 0.6, 0.61)
  Top 0.305: IOH.4 34.04,62.61 34.92,63.5 v40.01,63.5
  Top 0.406: ZIC1.17 34.92,27.05 36.22,28.35 36.22,31.67 34.8,33.15 34.8,39.24 35.05,39.5 v35.05,39.75
  Bottom 0.305: U4.12 37.47,69.85 40.01,67.31 v40.01,63.5
  Bottom 0.381: 64.92,33.25 64.92,36.73
  Bottom 0.406: IOH.4 34.04,56.01 36.32,53.72 36.32,41.02 v35.05,39.75 | ICSP.4 66.18,37.99 64.92,36.73 | 64.92,33.25 65.79,32.39 65.79,27.18 63.88,25.27 47.24,25.27 46.35,24.38 46.35,21.34 45.85,20.83 44.45,20.83 43.69,20.07 37.72,20.07 ZIC1.17
MOSI2
  Top 0.254: U3.16 22.32,50.01 22.48,50.17 22.48,50.67 19.68,53.47 19.3,53.47 18.29,54.48 ICSP1.4
N$2
  Top 0.305: L.A 27.27,51.69 RN2.1 26.35,50.73 26.29,50.67 26.29,50.04 26.4,49.93 RN2.2
N$3
  Top 0.305: RN4.6 56.62,44.85 56.39,45.08 56.39,45.72 | 56.39,45.72 56.39,46.1 ON.A | RN4.5 56.95,45.65 56.9,45.59 56.52,45.59 56.39,45.72
N$4  (2 unrouted)
  Top 0.406: JP_MAX485.7 55.88,64.14 | 53.98,66.04 MAX485.1
N$5  (2 unrouted)
  Top 0.406: MAX485.2 54.61,67.31 | 58.42,63.5 JP_MAX485.5
N$6  (2 unrouted)
  Top 0.406: MAX485.3 55.24,68.58
N$7  (2 unrouted)
  Top 0.406: MAX485.4 56.52,69.85
N$9  (3 unrouted)
N$10  (3 unrouted)
N$35
  Top 0.406: RX.A 29.97,44.45 30.48,44.96 30.48,47.5 29.59,48.39 29.59,48.64 29.1,49.13 RN2.6
N$36
  Top 0.305: RN2.5 28.61,47.36 TX.A
PWRIN
  Top 0.61: D1.A 14.68,21.79 13.21,20.32 X1.2
RD+
  Top 0.254: U3.29 15.26,48.01 14.35,48.92 14.35,50.42 14.1,50.67 13.56,50.67 RN3.4
RD-
  Top 0.254: U3.30 14.86,47.51 14.04,48.33 RN3.1
RESET  (via drill 0.61)
  Top 0.305: RESET-EN.1 27.18,39.37 27.43,39.62 27.81,39.62 C5.2 | 29.84,38.1 29.86,38.08
  Top 0.406: RESET-EN.2 RESET-EN.1 | ICSP.5 63.64,32.91 62.87,32.13 ZIC1.1 | 29.21,38.1 RESET-EN.2 | 29.21,38.1 29.84,38.1 31.11,38.1 34.04,41.02 52.2,41.02 53.76,39.46 53.76,38.95 v57.15,35.56 | v57.15,35.56 58.85,35.56 RESET.1 | POWER.1 32.38,13.34 32.38,17.78 28.57,21.59 28.57,31.5 30.48,33.4 30.48,36.83 29.21,38.1 | v57.15,35.56 51.05,35.56 RESET.2 | RN1.4 28.61,38.01 RESET-EN.2
  Bottom 0.406: ZIC1.1 60.4,32.82 59.89,32.82 v57.15,35.56
RESET2  (via drill 0.61)
  Top 0.254: U3.24 17.3,53.82 17.02,54.1
  Top 0.305: v22.48,56.52 22.48,57.91 21.46,58.93 17.02,58.93 ICSP1.5 17.02,56.39 17.02,54.1
  Top 0.406: RN1.6 v25.84,34.69 v25.83,34.7
  Bottom 0.406: v22.48,56.52 22.48,52.2 21.59,51.31 21.59,46.99 22.1,46.48 22.1,38.81 22.35,38.81 v25.83,34.7
RSV@1
  Top 0.406: R4.1 14.24,81.64 14.61,81.28 14.61,77.47 12.61,75.47 JP2.RSV1
RSV@2
  Top 0.406: R5.1 12.61,63.96 JP2.RSV2
RX  (via drill 0.61)
  Top 0.305: RN4.2 60.22,44.05 v61.21,43.05
  Top 0.406: IOL.1 60.96,57.78 56.52,57.78 55.88,58.42 JP_MAX485.8
  Bottom 0.406: ZIC1.2 60.2,30.35 55.88,34.67 55.88,39.5 56.64,40.26 59.05,40.26 61.21,42.42 v61.21,43.05 60.83,43.43 56.64,43.43 55.88,44.2 55.88,46.36 59.03,49.5 59.96,49.5 63.5,53.04 IOL.1
RXLED
  Top 0.254: U3.10 24.24,47.01 RX.C
SCK  (via drill 0.61)
  Top 0.305: RN2.7 29.23,49.93 29.34,50.04 29.34,50.73
  Top 0.406: RN2.8 29.34,50.73 29.77,50.73 31.11,52.07 31.11,54.36 v31.37,54.61
  Bottom 0.305: IOH.6 29.84,61.85 29.84,70.48 30.48,71.12 U4.11
  Bottom 0.406: 40.01,23.62 ZIC1.19 40.01,23.75 | ICSP.3 63.58,38.05 62.1,36.58 62.1,34.92 65.02,32 65.02,27.56 63.63,26.16 46.48,26.16 44.96,24.64 40.89,24.64 40.01,23.75 | 40.01,23.75 40.01,24.13 38.73,25.4 36.83,25.4 35.31,26.92 29.34,26.92 27.81,28.45 27.81,32 29.84,34.04 29.84,35.31 31.11,36.58 31.11,38.61 34.16,41.66 34.16,51.82 v31.37,54.61 28.96,57.02 IOH.6
SCK2
  Top 0.254: U3.15 22.71,49.51 23.11,49.91 23.11,50.93 19.56,54.48 19.56,56.39 ICSP1.3
SCK_3V3  (via drill 0.6 pad 0.6)
  Top 0.305: v19.05,69.85 12.7,69.85 JP2.SCLK
  Bottom 0.305: v19.05,69.85 19.68,70.48 23.5,70.48 24.13,71.12 U4.4
SS  (via drill 0.61)
  Top 0.406: v33.53,38.1 33.53,36.2 33.78,35.94 33.78,34.09 33.68,33.98 33.68,28.98 32.38,27.69 ZIC1.16
  Bottom 0.406: v33.53,38.1 33.78,38.35 35.18,38.35 37.59,40.77 37.59,54.61 36.58,55.63 IOH.3
TX  (via drill 0.61)
  Top 0.406: RN4.1 59.09,42.02 v59.13,41.99
  Bottom 0.406: ZIC1.3 57.78,31.24 55.14,33.88 55.14,39.9 56.52,41.27 58.42,41.27 v59.13,41.99 59,42.11 58.85,42.11 58.42,42.55 56.39,42.55 55.12,43.81 55.12,46.56 58.72,50.17 59.69,50.17 60.33,50.8 60.33,54.61 IOL.2 | IOL.2 60.96,54.99 | IOL.2 60.96,57.78 JP_MAX485.2
TXLED
  Top 0.254: U3.11 26.28,47.51 TX.C
UGND
  Top 0.305: 15.11,50.55 15.11,49.1 15.7,48.51 U3.28
  Top 0.406: 15.11,50.55 15.11,52.45 14.22,53.34 13.08,53.34 C8.2
  Top 0.61: L1.1 10.79,55.25 11.43,54.61 C8.2
  Top 0.813: L1.1 8.85,54.57 4.45,50.17 4.45,47.62 5.08,46.99 6.5,46.99 X2.4
  Bottom 0.813: X2.4 5.06,47.01 4.45,47.62 4.45,50.17 5.71,51.44 10.03,51.44 GROUND.2
USBVCC
  Top 0.254: U3.31 15.39,47.01 14.99,46.61
  Top 0.406: 14.99,46.61 14.99,46.48 14.1,45.72 12.7,45.72
  Top 0.61: 12.7,45.72 11.43,44.45 11.43,41.91 10.16,40.64 8.26,40.64 6.35,38.73 6.35,37.51 F1.1 3.43,34.63 T1.1
USHIELD  (via drill 0.61)
  Top 0.61: Z1.2 10.41,52.07 v9.53,52.96 | Z2.2 11.7,46.62 8.53,43.45
  Top 0.813: L1.2 4.79,55.25 X2.P$1 | 8.53,43.45 5,43.45 X2.P$2
  Bottom 0.61: v9.53,52.96 5.11,52.96 X2.P$1
  Bottom 0.813: X2.P$2 3.68,44.83 2.67,45.85 2.67,51.94 3.81,53.09 X2.P$1
VIN  (via drill 0.61)
  Top 0.305: 12.7,29.84 12.7,30.34 16.65,34.29 24.77,34.29 25.4,33.66 26.29,33.66 26.52,33.89 RN1.7
  Top 0.61: PC1.+ 27.25,18.49 25.91,18.49 v25.65,18.24 25.4,18.49 22.78,18.49 22.23,19.05 22.23,19.43 20.83,20.95 20.61,20.95 D1.C 19.05,22.86 18.41,23.5 18.41,23.88 17.4,24.89 17.4,25.15 13.97,28.57 12.7,29.84 | v48.26,18.41 46.35,18.41 45.72,17.78 POWER.6 | IC1.3 11.75,29.87 IC2.3 12.7,29.84 | 12.7,29.84 12.84,29.84 12.7,29.84
  Bottom 0.61: v25.65,18.24 48.08,18.24 v48.26,18.41
VUCAP
  Top 0.254: U3.27 16.22,49.01 16,49.22 16,50.67
  Top 0.406: 16,50.67 16.13,51.05
  Top 0.61: 16.13,51.05 16.13,52.7 14.22,54.61 C8.1
XT1
  Top 0.254: Y1.3 15.51,42.28 15.11,42.67 R3.2
  Top 0.305: R1.1 15.66,37.81 15.24,38.23 15.24,40 15.51,40.27 Y1.3
  Top 0.508: C9.1 R1.1 | Y1.3 Q1.2
XT1R
  Top 0.254: 17.3,46 U3.1 17.3,44.35 R3.1
XT2
  Top 0.254: U3.2 17.8,42.91 17.51,42.56 Y1.1
  Top 0.305: R1.2 17.36,37.68 17.78,38.1 17.78,40 17.51,40.27 Y1.1
  Top 0.508: R1.2 C11.1 | Y1.1 Q1.1
XTAL1
  Top 0.406: Y2.3 41.64,36.81 R2.1 C10.2 | ZIC1.9 42.55,33.39 Y2.3 | Y2.3 Q2.2
XTAL2
  Top 0.406: Y2.1 39.64,30.72 ZIC1.10 | Y2.1 39.66,34.31 39.66,36.7 R2.2 C12.2 | Y2.1 Q2.1
XUSB
  Top 0.813: F1.2 2.5,38.14 1.4,39.24 1.4,43.94 2.54,45.08 7.62,45.08 8.51,45.97 X2.1

### Text on the board
tPlace: 13 | 12 | 11 | 10 | 9 | 8 | 7 | 6 | 5 | 4 | 3 | 2 | 2010d
tNames: AREF | GND | # | # | # | # | # | # | [#=PWM] | TX | RX | TX | PM&MC&NW<3 | RX | 1 | ANALOG IN | A0 | A1 | A2 | A3 | A4 | A5 | RESET | 3V3 | 5V | GND | VIN
ReferenceLC: L | TX | RX | PC1 | PC2
214bmp: D:/SmartProjects/Snc/a4_bn_logo2.bmp